# EAGLE design rev_3 (EAGLE 5.10)

## Sheet 1 of 2
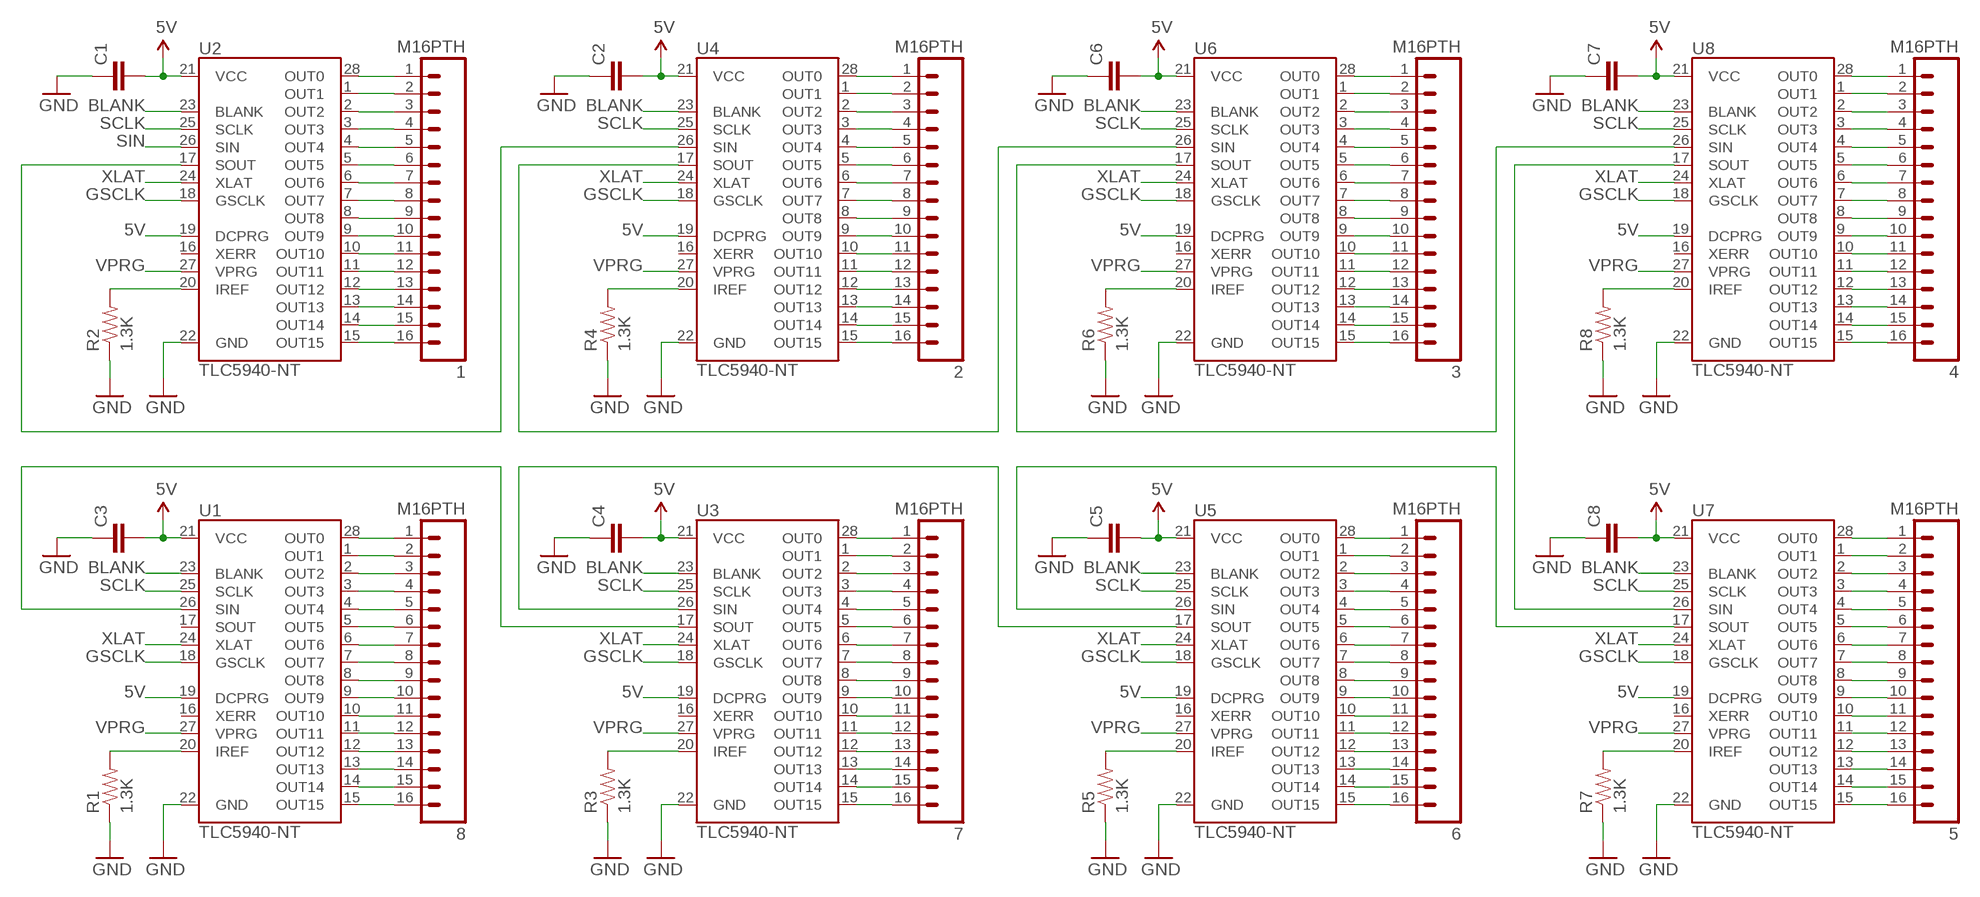
[diagram p0: schematic, sheet 1]

### Parts
1  M16PTH  [1X16]
2  M16PTH  [1X16]
3  M16PTH  [1X16]
4  M16PTH  [1X16]
5  M16PTH  [1X16]
6  M16PTH  [1X16]
7  M16PTH  [1X16]
8  M16PTH  [1X16]
C1  CAPKIT  [CAP-PTH-SMALL-KIT]
C2  CAPKIT  [CAP-PTH-SMALL-KIT]
C3  CAPKIT  [CAP-PTH-SMALL-KIT]
C4  CAPKIT  [CAP-PTH-SMALL-KIT]
C5  CAPKIT  [CAP-PTH-SMALL-KIT]
C6  CAPKIT  [CAP-PTH-SMALL-KIT]
C7  CAPKIT  [CAP-PTH-SMALL-KIT]
C8  CAPKIT  [CAP-PTH-SMALL-KIT]
R1  1.3K  RESISTORPTH-1/6W  [1/6W-RES]
R2  1.3K  RESISTORPTH-1/6W  [1/6W-RES]
R3  1.3K  RESISTORPTH-1/6W  [1/6W-RES]
R4  1.3K  RESISTORPTH-1/6W  [1/6W-RES]
R5  1.3K  RESISTORPTH-1/6W  [1/6W-RES]
R6  1.3K  RESISTORPTH-1/6W  [1/6W-RES]
R7  1.3K  RESISTORPTH-1/6W  [1/6W-RES]
R8  1.3K  RESISTORPTH-1/6W  [1/6W-RES]
U1  TLC5940-NT  [DIL28-3]
U2  TLC5940-NT  [DIL28-3]
U3  TLC5940-NT  [DIL28-3]
U4  TLC5940-NT  [DIL28-3]
U5  TLC5940-NT  [DIL28-3]
U6  TLC5940-NT  [DIL28-3]
U7  TLC5940-NT  [DIL28-3]
U8  TLC5940-NT  [DIL28-3]

### Nets
5V: C1.2 C2.2 C3.2 C4.2 C5.2 C6.2 C7.2 C8.2 U1.19(DCPRG) U1.21(VCC) U2.19(DCPRG) U2.21(VCC) U3.19(DCPRG) U3.21(VCC) U4.19(DCPRG) U4.21(VCC) U5.19(DCPRG) U5.21(VCC) U6.19(DCPRG) U6.21(VCC) U7.19(DCPRG) U7.21(VCC) U8.19(DCPRG) U8.21(VCC) ; also sheet 2
BLANK: U1.23(BLANK) U2.23(BLANK) U3.23(BLANK) U4.23(BLANK) U5.23(BLANK) U6.23(BLANK) U7.23(BLANK) U8.23(BLANK)
GND: C1.1 C2.1 C3.1 C4.1 C5.1 C6.1 C7.1 C8.1 R1.1 R2.1 R3.1 R4.1 R5.1 R6.1 R7.1 R8.1 U1.22(GND) U2.22(GND) U3.22(GND) U4.22(GND) U5.22(GND) U6.22(GND) U7.22(GND) U8.22(GND) ; also sheet 2
GSCLK: U1.18(GSCLK) U2.18(GSCLK) U3.18(GSCLK) U4.18(GSCLK) U5.18(GSCLK) U6.18(GSCLK) U7.18(GSCLK) U8.18(GSCLK)
N$1: 8.1 U1.28(OUT0)
N$2: 8.2 U1.1(OUT1)
N$3: 8.3 U1.2(OUT2)
N$4: 8.4 U1.3(OUT3)
N$5: 8.5 U1.4(OUT4)
N$6: 8.6 U1.5(OUT5)
N$7: 8.7 U1.6(OUT6)
N$8: 8.8 U1.7(OUT7)
N$9: 8.9 U1.8(OUT8)
N$10: 8.10 U1.9(OUT9)
N$11: 8.11 U1.10(OUT10)
N$12: 8.12 U1.11(OUT11)
N$13: 8.13 U1.12(OUT12)
N$14: 8.14 U1.13(OUT13)
N$15: 8.15 U1.14(OUT14)
N$16: 8.16 U1.15(OUT15)
N$17: R1.2 U1.20(IREF)
N$18: R2.2 U2.20(IREF)
N$19: 1.1 U2.28(OUT0)
N$20: 1.2 U2.1(OUT1)
N$23: 1.3 U2.2(OUT2)
N$24: 1.4 U2.3(OUT3)
N$25: 1.5 U2.4(OUT4)
N$26: 1.6 U2.5(OUT5)
N$27: 1.7 U2.6(OUT6)
N$28: 1.8 U2.7(OUT7)
N$29: 1.9 U2.8(OUT8)
N$30: 1.10 U2.9(OUT9)
N$31: 1.11 U2.10(OUT10)
N$32: 1.12 U2.11(OUT11)
N$33: 1.13 U2.12(OUT12)
N$34: 1.14 U2.13(OUT13)
N$35: 1.15 U2.14(OUT14)
N$36: 1.16 U2.15(OUT15)
N$37: U2.17(SOUT) U4.26(SIN)
N$39: R3.2 U3.20(IREF)
N$40: 7.1 U3.28(OUT0)
N$41: 7.2 U3.1(OUT1)
N$42: 7.3 U3.2(OUT2)
N$43: 7.4 U3.3(OUT3)
N$44: 7.5 U3.4(OUT4)
N$45: 7.6 U3.5(OUT5)
N$46: 7.7 U3.6(OUT6)
N$47: 7.8 U3.7(OUT7)
N$48: 7.9 U3.8(OUT8)
N$49: 7.10 U3.9(OUT9)
N$50: 7.11 U3.10(OUT10)
N$51: 7.12 U3.11(OUT11)
N$52: 7.13 U3.12(OUT12)
N$53: 7.14 U3.13(OUT13)
N$54: 7.15 U3.14(OUT14)
N$55: 7.16 U3.15(OUT15)
N$56: U1.26(SIN) U3.17(SOUT)
N$58: R4.2 U4.20(IREF)
N$59: 2.1 U4.28(OUT0)
N$60: 2.2 U4.1(OUT1)
N$61: 2.3 U4.2(OUT2)
N$62: 2.4 U4.3(OUT3)
N$63: 2.5 U4.4(OUT4)
N$64: 2.6 U4.5(OUT5)
N$65: 2.7 U4.6(OUT6)
N$66: 2.8 U4.7(OUT7)
N$67: 2.9 U4.8(OUT8)
N$68: 2.10 U4.9(OUT9)
N$69: 2.11 U4.10(OUT10)
N$70: 2.12 U4.11(OUT11)
N$71: 2.13 U4.12(OUT12)
N$72: 2.14 U4.13(OUT13)
N$73: 2.15 U4.14(OUT14)
N$74: 2.16 U4.15(OUT15)
N$75: U4.17(SOUT) U6.26(SIN)
N$77: R5.2 U5.20(IREF)
N$78: 6.1 U5.28(OUT0)
N$79: 6.2 U5.1(OUT1)
N$80: 6.3 U5.2(OUT2)
N$81: 6.4 U5.3(OUT3)
N$82: 6.5 U5.4(OUT4)
N$83: 6.6 U5.5(OUT5)
N$84: 6.7 U5.6(OUT6)
N$85: 6.8 U5.7(OUT7)
N$86: 6.9 U5.8(OUT8)
N$87: 6.10 U5.9(OUT9)
N$88: 6.11 U5.10(OUT10)
N$89: 6.12 U5.11(OUT11)
N$90: 6.13 U5.12(OUT12)
N$91: 6.14 U5.13(OUT13)
N$92: 6.15 U5.14(OUT14)
N$93: 6.16 U5.15(OUT15)
N$94: U3.26(SIN) U5.17(SOUT)
N$96: R6.2 U6.20(IREF)
N$97: 3.1 U6.28(OUT0)
N$98: 3.2 U6.1(OUT1)
N$99: 3.3 U6.2(OUT2)
N$100: 3.4 U6.3(OUT3)
N$101: 3.5 U6.4(OUT4)
N$102: 3.6 U6.5(OUT5)
N$103: 3.7 U6.6(OUT6)
N$104: 3.8 U6.7(OUT7)
N$105: 3.9 U6.8(OUT8)
N$106: 3.10 U6.9(OUT9)
N$107: 3.11 U6.10(OUT10)
N$108: 3.12 U6.11(OUT11)
N$109: 3.13 U6.12(OUT12)
N$110: 3.14 U6.13(OUT13)
N$111: 3.15 U6.14(OUT14)
N$112: 3.16 U6.15(OUT15)
N$113: U6.17(SOUT) U8.26(SIN)
N$115: R7.2 U7.20(IREF)
N$116: 5.1 U7.28(OUT0)
N$117: 5.2 U7.1(OUT1)
N$118: 5.3 U7.2(OUT2)
N$119: 5.4 U7.3(OUT3)
N$120: 5.5 U7.4(OUT4)
N$121: 5.6 U7.5(OUT5)
N$122: 5.7 U7.6(OUT6)
N$123: 5.8 U7.7(OUT7)
N$124: 5.9 U7.8(OUT8)
N$125: 5.10 U7.9(OUT9)
N$126: 5.11 U7.10(OUT10)
N$127: 5.12 U7.11(OUT11)
N$128: 5.13 U7.12(OUT12)
N$129: 5.14 U7.13(OUT13)
N$130: 5.15 U7.14(OUT14)
N$131: 5.16 U7.15(OUT15)
N$132: U5.26(SIN) U7.17(SOUT)
N$134: R8.2 U8.20(IREF)
N$135: 4.1 U8.28(OUT0)
N$136: 4.2 U8.1(OUT1)
N$137: 4.3 U8.2(OUT2)
N$138: 4.4 U8.3(OUT3)
N$139: 4.5 U8.4(OUT4)
N$140: 4.6 U8.5(OUT5)
N$141: 4.7 U8.6(OUT6)
N$142: 4.8 U8.7(OUT7)
N$143: 4.9 U8.8(OUT8)
N$144: 4.10 U8.9(OUT9)
N$145: 4.11 U8.10(OUT10)
N$146: 4.12 U8.11(OUT11)
N$147: 4.13 U8.12(OUT12)
N$148: 4.14 U8.13(OUT13)
N$149: 4.15 U8.14(OUT14)
N$150: 4.16 U8.15(OUT15)
N$151: U7.26(SIN) U8.17(SOUT)
SCLK: U1.25(SCLK) U2.25(SCLK) U3.25(SCLK) U4.25(SCLK) U5.25(SCLK) U6.25(SCLK) U7.25(SCLK) U8.25(SCLK)
SIN: U2.26(SIN)
VPRG: U1.27(VPRG) U2.27(VPRG) U3.27(VPRG) U4.27(VPRG) U5.27(VPRG) U6.27(VPRG) U7.27(VPRG) U8.27(VPRG)
XLAT: U1.24(XLAT) U2.24(XLAT) U3.24(XLAT) U4.24(XLAT) U5.24(XLAT) U6.24(XLAT) U7.24(XLAT) U8.24(XLAT)
Unconnected: U1.16(XERR) U1.17(SOUT) U2.16(XERR) U3.16(XERR) U4.16(XERR) U5.16(XERR) U6.16(XERR) U7.16(XERR) U8.16(XERR)

## Sheet 2 of 2
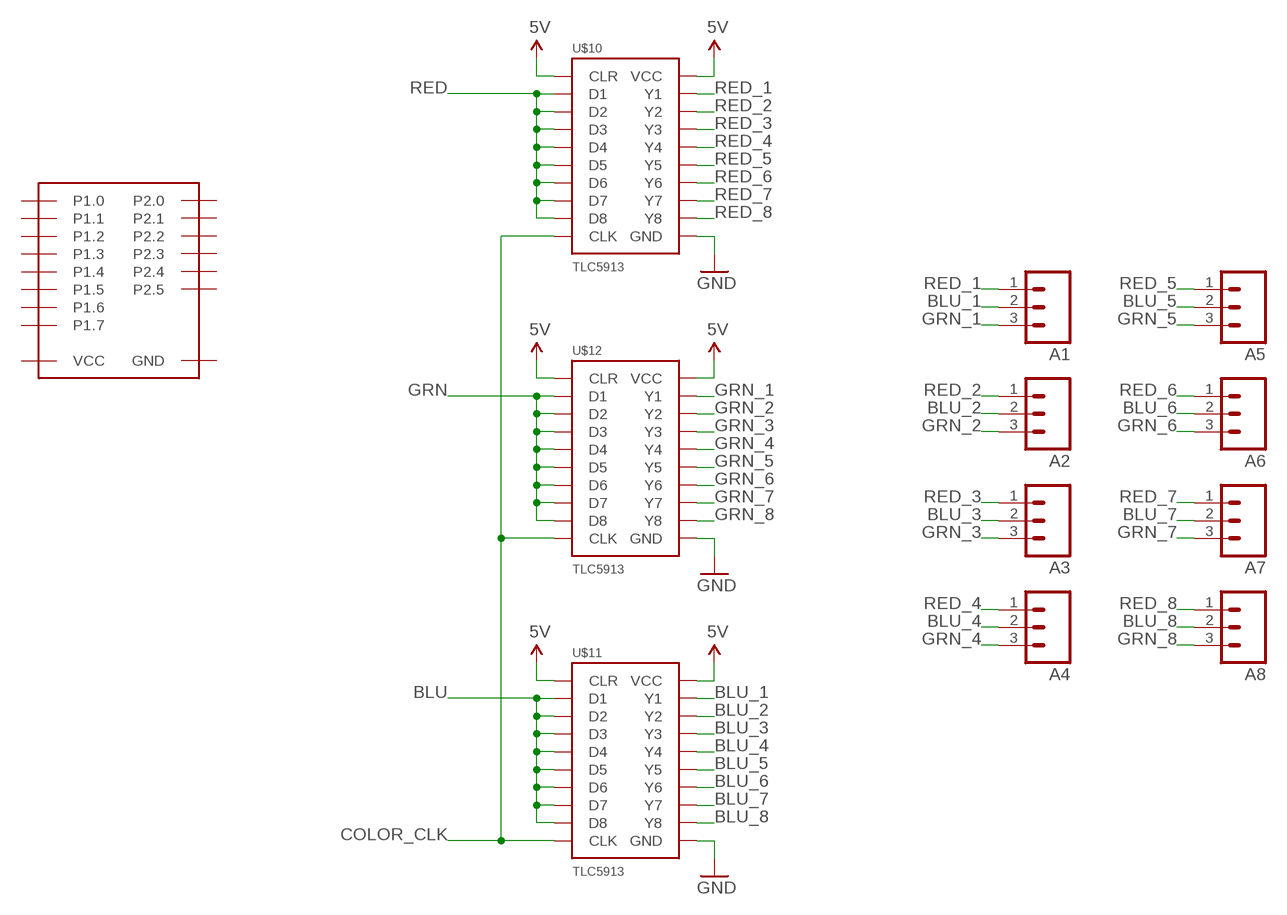
[diagram p1: schematic, sheet 2]

### Parts
A1  M03PTH  [1X03]
A2  M03PTH  [1X03]
A3  M03PTH  [1X03]
A4  M03PTH  [1X03]
A5  M03PTH  [1X03]
A6  M03PTH  [1X03]
A7  M03PTH  [1X03]
A8  M03PTH  [1X03]
U$9  TI_LAUNCHPAD  [TI_LAUNCHPAD]
U$10  TLC5913  [TLC59213]
U$11  TLC5913  [TLC59213]
U$12  TLC5913  [TLC59213]

### Nets
5V: U$10.CLR U$10.VCC U$11.CLR U$11.VCC U$12.CLR U$12.VCC ; also sheet 1
BLU: U$11.D1 U$11.D2 U$11.D3 U$11.D4 U$11.D5 U$11.D6 U$11.D7 U$11.D8
BLU_1: A1.2 U$11.Y1
BLU_2: A2.2 U$11.Y2
BLU_3: A3.2 U$11.Y3
BLU_4: A4.2 U$11.Y4
BLU_5: A5.2 U$11.Y5
BLU_6: A6.2 U$11.Y6
BLU_7: A7.2 U$11.Y7
BLU_8: A8.2 U$11.Y8
COLOR_CLK: U$10.CLK U$11.CLK U$12.CLK
GND: U$10.GND U$11.GND U$12.GND ; also sheet 1
GRN: U$12.D1 U$12.D2 U$12.D3 U$12.D4 U$12.D5 U$12.D6 U$12.D7 U$12.D8
GRN_1: A1.3 U$12.Y1
GRN_2: A2.3 U$12.Y2
GRN_3: A3.3 U$12.Y3
GRN_4: A4.3 U$12.Y4
GRN_5: A5.3 U$12.Y5
GRN_6: A6.3 U$12.Y6
GRN_7: A7.3 U$12.Y7
GRN_8: A8.3 U$12.Y8
RED: U$10.D1 U$10.D2 U$10.D3 U$10.D4 U$10.D5 U$10.D6 U$10.D7 U$10.D8
RED_1: A1.1 U$10.Y1
RED_2: A2.1 U$10.Y2
RED_3: A3.1 U$10.Y3
RED_4: A4.1 U$10.Y4
RED_5: A5.1 U$10.Y5
RED_6: A6.1 U$10.Y6
RED_7: A7.1 U$10.Y7
RED_8: A8.1 U$10.Y8
Unconnected: U$9.GND U$9.P1.0 U$9.P1.1 U$9.P1.2 U$9.P1.3 U$9.P1.4 U$9.P1.5 U$9.P1.6 U$9.P1.7 U$9.P2.0 U$9.P2.1 U$9.P2.2 U$9.P2.3 U$9.P2.4 U$9.P2.5 U$9.VCC

## Library data of the parts
1-8 = SparkFun:M16
A1-A8 = SparkFun:M03: Header 3 Standard 3-pin 0.1" header. Use with straight break away headers (SKU : PRT-00116), right angle break away headers (PRT-00553), swiss pins (PRT-00743), machine pins (PRT-00117), and female headers (PRT-00115). Molex polarized connector foot print use with SKU : PRT-08232 with associated crimp pins and housings.
C1-C8 = SparkFun:CAP: Capacitor Standard 0603 ceramic capacitor, and 0.1" leaded capacitor.
R1-R8 = SparkFun:RESISTOR: Resistor Basic schematic elements and footprints for 0603, 1206, and PTH resistors.
U1-U8 = SparkFun:TLC5940: TI TLC5940 16-channel LED Driver with Dot Correction and Grayscale PWM Control The TLC5940 is a 16-channel, constant-current sink LED driver. Each channel has an individually adjustable 4096-step grayscale PWM brightness control and a 64-step, constant-current sink (dot correction). The dot correction adjusts the brightness variations between LED channels and other LED drivers. The dot correction data is stored in an integrated EEPROM. Both grayscale control and dot correction are accessible via a serial interface. A single external resistor sets the maximum current value of all 16 channels. Packages: 28-pin HTSSOP 32-pin 5x5mm QFN 28-pin DIP
U$9 = launchpad_comp:TI_LAUNCHPAD
U$10-U$12 = launchpad_comp:TLC5913: TLC59213A http://focus.ti.com/docs/prod/folders/print/tlc59213a.html; VALUE: TLC59213A

## Board
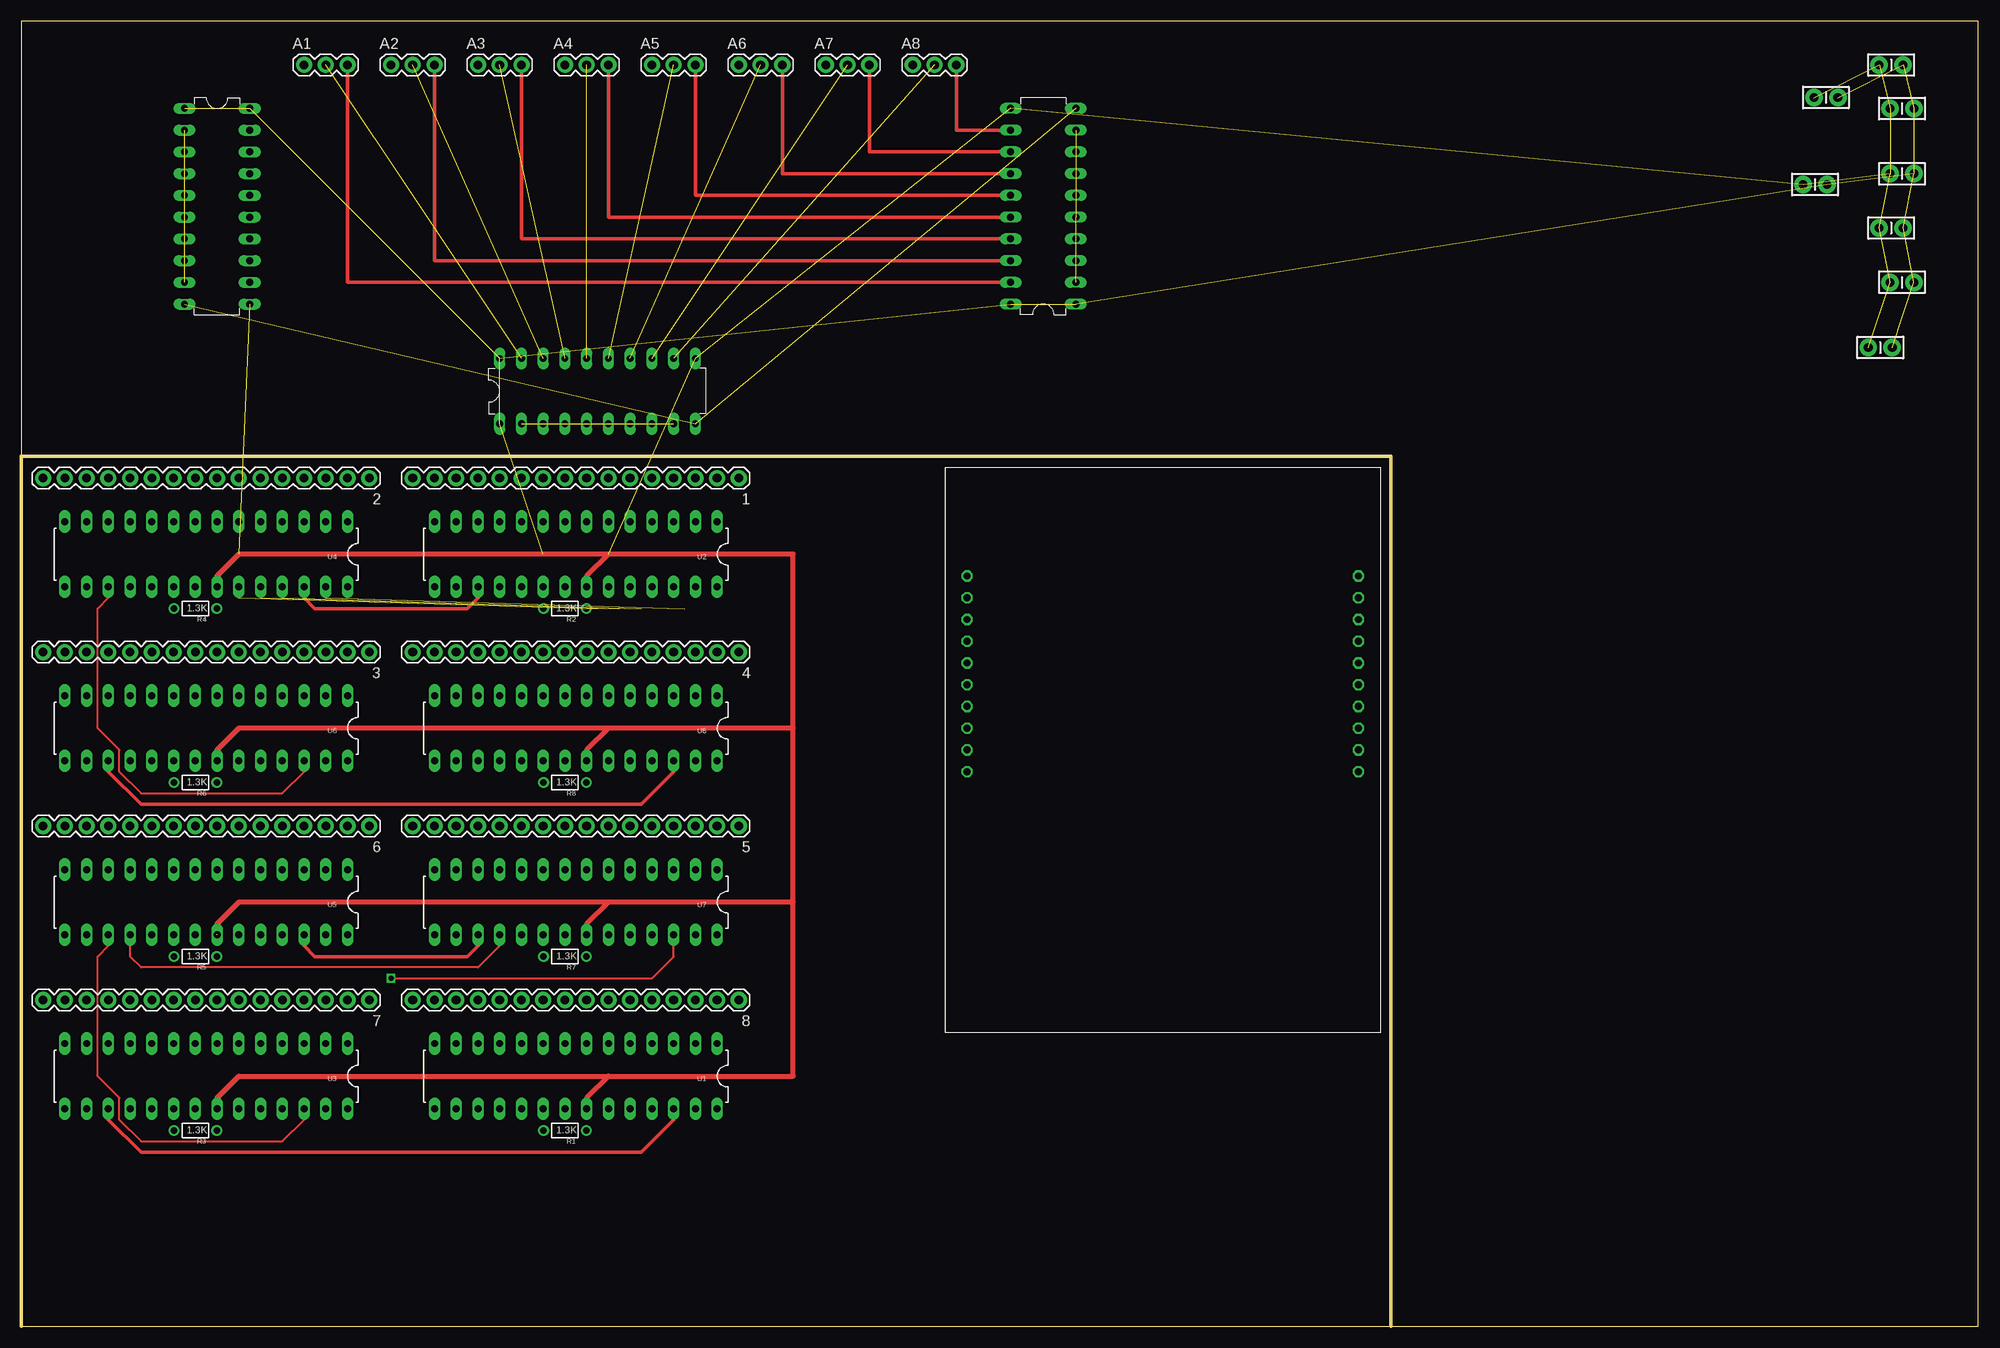
[diagram p2: board, top side]
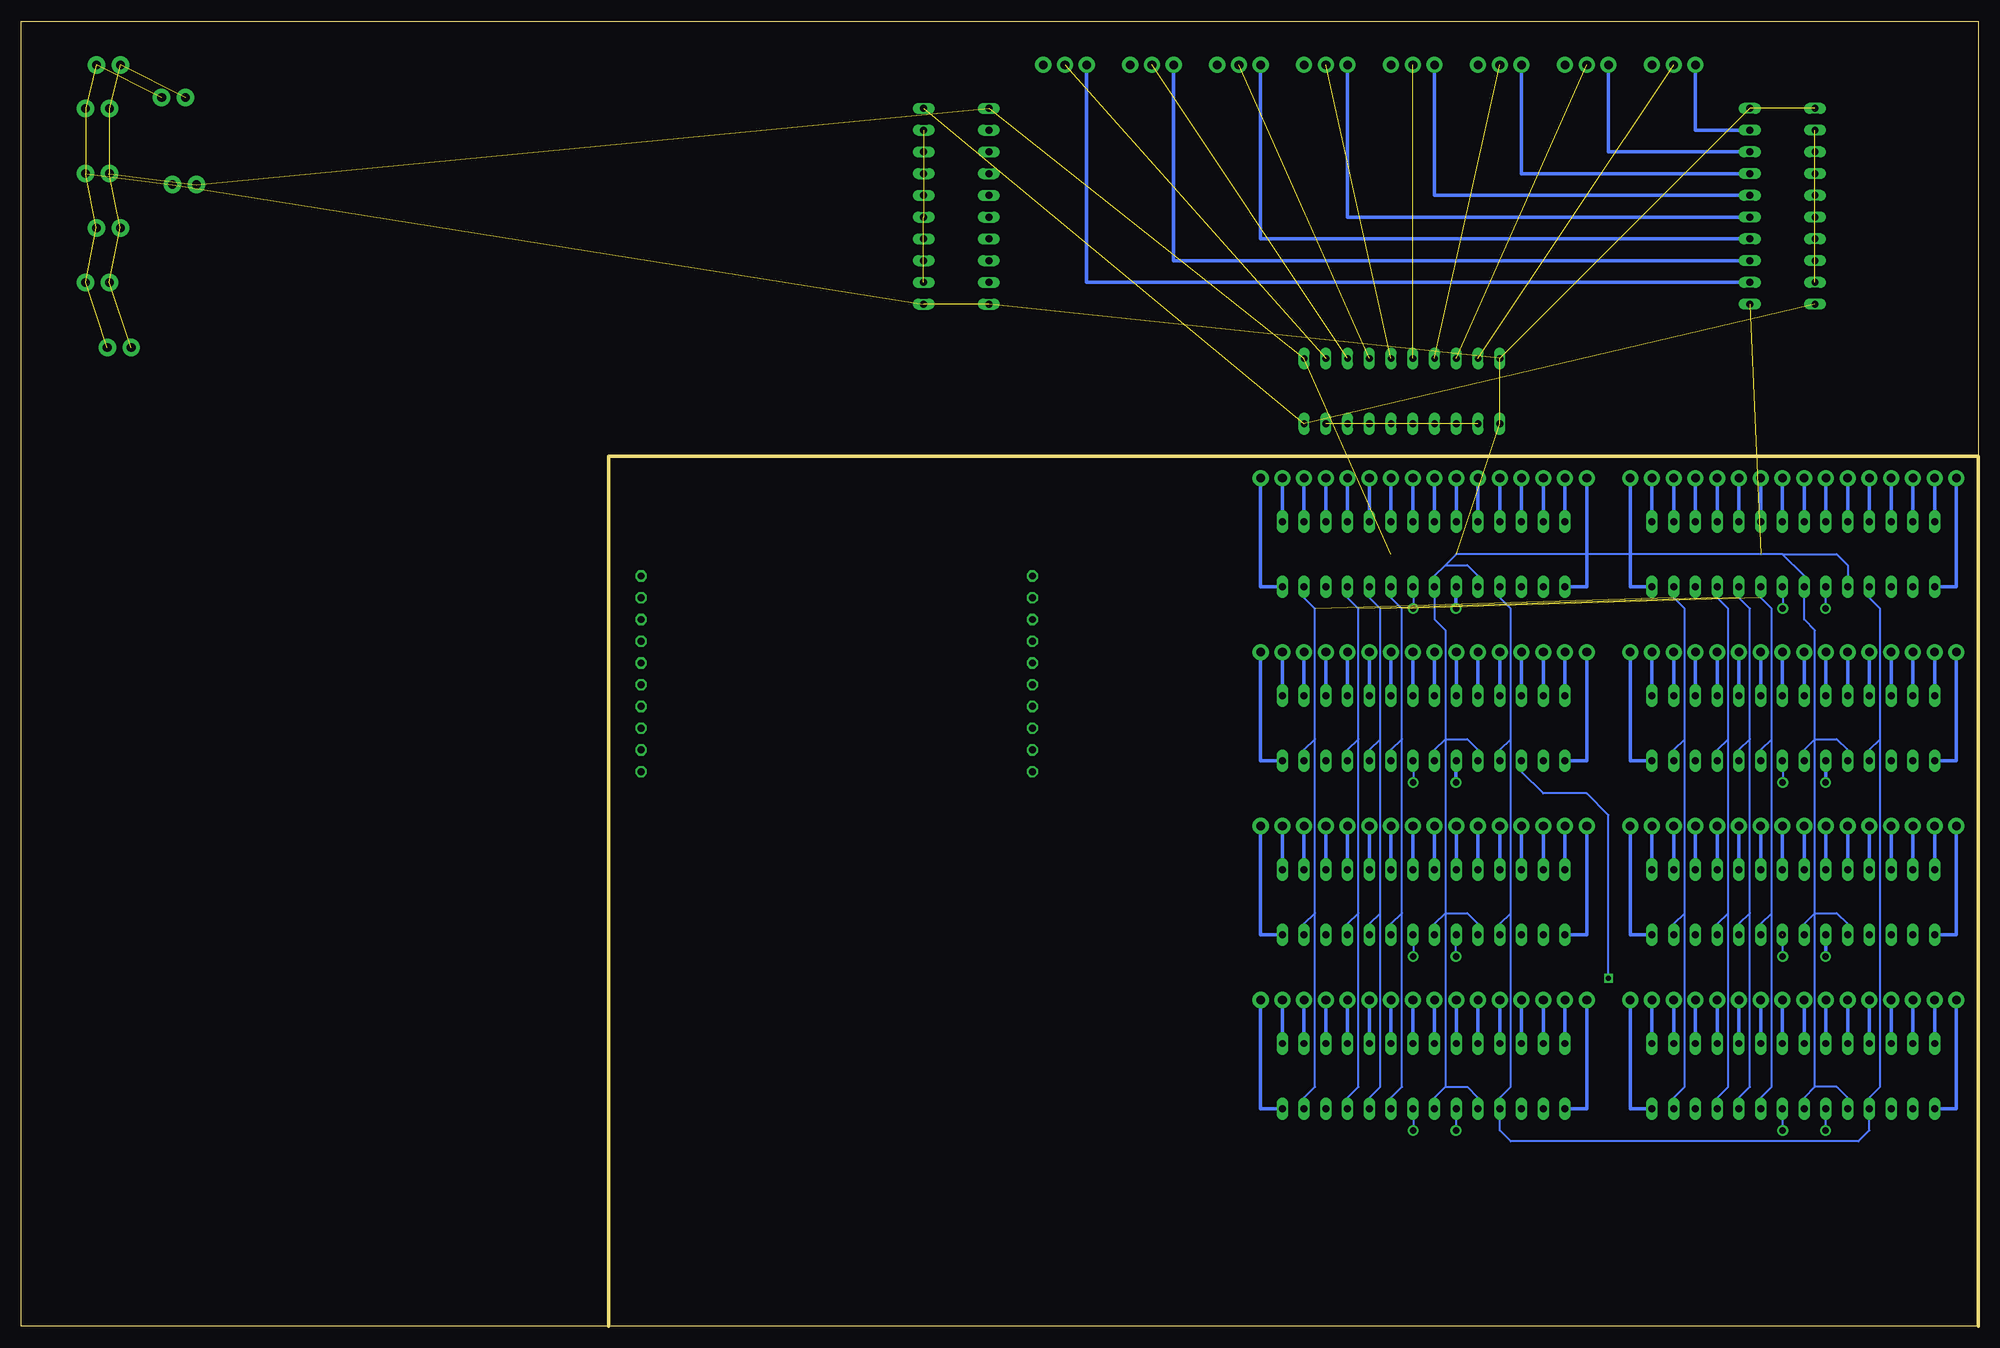
[diagram p3: board, bottom side, seen from below]

Size 228.6 x 152.4 mm. Coordinates in mm from the lower left corner, seen from the top.
Outline: 160.02,0 0,0 0,101.6
Outline: 160.02,0 228.6,0 228.6,152.4 0,152.4 0,101.6
Outline: 0,101.6 160.02,101.6 160.02,0
Copper layers (1*16): Top 0.0356mm / dielectric 1.5011mm / Bottom 0.0356mm
Design rules "SilverCircuits": minimum track width 7mil, minimum drill 14mil, track to track 7mil, track to pad 7mil, pad to pad 7mil, via to via 7mil, smd to smd 0mil, copper to edge 20mil, drill to drill 8mil, minimum pad ring 10mil, minimum via ring 8mil, stop-mask expansion 4mil, vias tented up to drill 0mil, thermal gap 10mil

### Footprints (pad centres in the part's own frame; a part is rotated, then mirrored left to right if it is on the bottom)
1X16 = drill 1.016 pad 1.88 round: 1 0,0; 2 2.54,0; 3 5.08,0; 4 7.62,0; 5 10.16,0; 6 12.7,0; 7 15.24,0; 8 17.78,0; 9 20.32,0; 10 22.86,0; 11 25.4,0; 12 27.94,0; 13 30.48,0; 14 33.02,0; 15 35.56,0; 16 38.1,0
1X03 = drill 1.016 pad 1.88 round: 1 0,0; 2 2.54,0; 3 5.08,0
CAP-PTH-SMALL-KIT = drill 1.016 pad 2.032 round: 1 -1.397,0; 2 1.397,0
1/6W-RES = drill 0.762 round: 1 -2.5,0; 2 2.5,0
DIL28-3 = drill 0.813 long: 1 -16.51,-3.81; 2 -13.97,-3.81; 3 -11.43,-3.81; 4 -8.89,-3.81; 5 -6.35,-3.81; 6 -3.81,-3.81; 7 -1.27,-3.81; 8 1.27,-3.81; 9 3.81,-3.81; 10 6.35,-3.81; 11 8.89,-3.81; 12 11.43,-3.81; 13 13.97,-3.81; 14 16.51,-3.81; 15 16.51,3.81; 16 13.97,3.81; 17 11.43,3.81; 18 8.89,3.81; 19 6.35,3.81; 20 3.81,3.81; 21 1.27,3.81; 22 -1.27,3.81; 23 -3.81,3.81; 24 -6.35,3.81; 25 -8.89,3.81; 26 -11.43,3.81; 27 -13.97,3.81; 28 -16.51,3.81
TI_LAUNCHPAD = drill 0.8 octagon: GND 48.26,35.56; P1.0 2.54,33.02; P1.1 2.54,30.48; P1.2 2.54,27.94; P1.3 2.54,25.4; P1.4 2.54,22.86; P1.5 2.54,20.32; P1.6 48.26,20.32; P1.7 48.26,22.86; P2.0 2.54,17.78; P2.1 2.54,15.24; P2.2 2.54,12.7; P2.3 48.26,12.7; P2.4 48.26,15.24; P2.5 48.26,17.78; RST 48.26,25.4; TEST 48.26,27.94; VCC 2.54,35.56; XIN 48.26,33.02; XOUT 48.26,30.48
TLC59213 = drill 0.8 long: CLK -10.16,3.81; CLR 12.7,3.81; D1 10.16,3.81; D2 7.62,3.81; D3 5.08,3.81; D4 2.54,3.81; D5 0,3.81; D6 -2.54,3.81; D7 -5.08,3.81; D8 -7.62,3.81; GND -10.16,-3.81; VCC 12.7,-3.81; Y1 10.16,-3.81; Y2 7.62,-3.81; Y3 5.08,-3.81; Y4 2.54,-3.81; Y5 0,-3.81; Y6 -2.54,-3.81; Y7 -5.08,-3.81; Y8 -7.62,-3.81

### Placement (x,y rotation side)
1  83.82,99.06 180 top
2  40.64,99.06 180 top
3  40.64,78.74 180 top
4  83.82,78.74 180 top
5  83.82,58.42 180 top
6  40.64,58.42 180 top
7  40.64,38.1 180 top
8  83.82,38.1 180 top
A1  33.02,147.32 0 top
A2  43.18,147.32 0 top
A3  53.34,147.32 0 top
A4  63.5,147.32 0 top
A5  73.66,147.32 0 top
A6  83.82,147.32 0 top
A7  93.98,147.32 0 top
A8  104.14,147.32 0 top
C1  219.71,121.92 0 top
C2  217.17,114.3 0 top
C3  210.82,143.51 0 top
C4  209.55,133.35 0 top
C5  219.71,134.62 0 top
C6  218.44,128.27 0 top
C7  218.44,147.32 0 top
C8  219.71,142.24 0 top
R1  63.5,22.86 180 top
R2  63.5,83.82 180 top
R3  20.32,22.86 180 top
R4  20.32,83.82 180 top
R5  20.32,43.18 180 top
R6  20.32,63.5 180 top
R7  63.5,43.18 180 top
R8  63.5,63.5 180 top
U1  64.77,29.21 180 top
U2  64.77,90.17 180 top
U3  21.59,29.21 180 top
U4  21.59,90.17 180 top
U5  21.59,49.53 180 top
U6  21.59,69.85 180 top
U7  64.77,49.53 180 top
U8  64.77,69.85 180 top
U$9  158.75,100.33 180 top
U$10  22.86,129.54 90 top
U$11  68.58,109.22 180 top
U$12  119.38,132.08 270 top

### Tracks (layer width: path | path; a pad name or v marks a point on that pad's centre or on a via)
5V  (14 unrouted)
  Bottom 0.254: 62.23,68.58 62.23,81.28 63.5,82.55 U2.21 63.5,87.63 62.23,88.9 | 62.23,68.58 62.23,48.26 | 62.23,48.26 62.23,27.94 | 62.23,27.94 63.5,26.67 U1.21 | U7.21 63.5,46.99 62.23,48.26 | U8.21 63.5,67.31 62.23,68.58 | 19.05,68.58 19.05,81.28 20.32,82.55 U4.21 20.32,87.63 22.86,90.17 | 19.05,48.26 19.05,68.58 | 19.05,27.94 19.05,48.26 | 19.05,27.94 20.32,26.67 U3.21 | U5.21 20.32,46.99 19.05,48.26 | U6.21 20.32,67.31 19.05,68.58 | 22.86,90.17 60.96,90.17 62.23,88.9 | U4.19 15.24,88.9 16.51,90.17 22.86,90.17 | U6.19 15.24,67.31 16.51,68.58 19.05,68.58 | U5.19 15.24,46.99 16.51,48.26 19.05,48.26 | U3.19 15.24,26.67 16.51,27.94 19.05,27.94 | U1.19 58.42,26.67 59.69,27.94 62.23,27.94 | U7.19 58.42,46.99 59.69,48.26 62.23,48.26 | U8.19 58.42,67.31 59.69,68.58 62.23,68.58 | U2.19 58.42,87.63 59.69,88.9 62.23,88.9
BLANK  (1 unrouted)
  Bottom 0.254: U2.23 68.58,85.09 67.31,83.82 67.31,68.58 | 67.31,48.26 67.31,68.58 | 67.31,48.26 67.31,27.94 68.58,26.67 U1.23 | U7.23 68.58,46.99 67.31,48.26 | U8.23 68.58,67.31 67.31,68.58 | U4.23 25.4,85.09 24.13,83.82 24.13,68.58 | 24.13,48.26 24.13,68.58 | 24.13,48.26 24.13,27.94 25.4,26.67 U3.23 | U5.23 25.4,46.99 24.13,48.26 | U6.23 25.4,67.31 24.13,68.58
BLU  (7 unrouted)
BLU_1  (1 unrouted)
BLU_2  (1 unrouted)
BLU_3  (1 unrouted)
BLU_4  (1 unrouted)
BLU_5  (1 unrouted)
BLU_6  (1 unrouted)
BLU_7  (1 unrouted)
BLU_8  (1 unrouted)
COLOR_CLK  (2 unrouted)
GND  (12 unrouted)
  Top 0.61: U4.22 22.86,87.63 25.4,90.17 68.58,90.17 | U2.22 66.04,87.63 68.58,90.17 | U6.22 22.86,67.31 25.4,69.85 68.58,69.85 | U8.22 66.04,67.31 68.58,69.85 | U3.22 22.86,26.67 25.4,29.21 68.58,29.21 | 22.82,45.72 22.82,46.95 25.4,49.53 68.58,49.53 | 90.17,49.53 68.58,49.53 | U1.22 66.04,26.67 68.58,29.21 | U7.22 66.04,46.99 68.58,49.53 | 68.58,29.21 90.17,29.21 90.17,49.53 | 90.17,69.85 68.58,69.85 | 90.17,49.53 90.17,69.85 | 68.58,90.17 90.17,90.17 90.17,69.85
  Bottom 0.254: R4.1 22.82,86.32 U4.22 | R2.1 66,86.32 U2.22 | R8.1 66,66 U8.22 | R6.1 22.82,66 U6.22 | R5.1 22.82,45.68 U5.22 | R7.1 66,45.68 U7.22 | R1.1 66,25.36 U1.22 | R3.1 22.82,25.36 U3.22
  Bottom 0.406: U2.22 66,86.36
GRN  (7 unrouted)
GRN_1
  Top 0.406: U$12.Y1 38.1,121.92 A1.3
GRN_2
  Top 0.406: U$12.Y2 48.26,124.46 A2.3
GRN_3
  Top 0.406: U$12.Y3 58.42,127 A3.3
GRN_4
  Top 0.406: U$12.Y4 68.58,129.54 A4.3
GRN_5
  Top 0.406: U$12.Y5 78.74,132.08 A5.3
GRN_6
  Top 0.406: U$12.Y6 88.9,134.62 A6.3
GRN_7
  Top 0.406: U$12.Y7 99.06,137.16 A7.3
GRN_8
  Top 0.406: U$12.Y8 109.22,139.7 A8.3
GSCLK
  Top 0.254: U5.18 12.7,43.18 13.97,41.91 53.34,41.91 55.88,44.45 U7.18
  Bottom 0.254: U2.18 55.88,85.09 54.61,83.82 54.61,68.58 | 54.61,48.26 54.61,68.58 | U8.18 55.88,67.31 54.61,68.58 | U4.18 12.7,85.09 11.43,83.82 11.43,68.58 | 11.43,68.58 11.43,27.94 12.7,26.67 U3.18 12.7,22.86 13.97,21.59 54.61,21.59 55.88,22.86 U1.18 55.88,26.67 54.61,27.94 54.61,48.26 | U6.18 12.7,67.31 11.43,68.58 | 54.61,48.26 55.88,46.99 U7.18
N$1
  Bottom 0.406: U1.28 83.82,25.4 8.1
N$2
  Bottom 0.406: U1.1 8.2
N$3
  Bottom 0.406: U1.2 8.3
N$4
  Bottom 0.406: U1.3 8.4
N$5
  Bottom 0.406: U1.4 8.5
N$6
  Bottom 0.406: U1.5 8.6
N$7
  Bottom 0.406: U1.6 8.7
N$8
  Bottom 0.406: U1.7 8.8
N$9
  Bottom 0.406: U1.8 8.9
N$10
  Bottom 0.406: U1.9 8.10
N$11
  Bottom 0.406: U1.10 8.11
N$12
  Bottom 0.406: U1.11 8.12
N$13
  Bottom 0.406: U1.12 8.13
N$14
  Bottom 0.406: U1.13 8.14
N$15
  Bottom 0.406: U1.14 8.15
N$16
  Bottom 0.406: U1.15 45.72,25.4 8.16
N$17
  Bottom 0.254: U1.20 60.96,22.9 R1.2
N$18
  Bottom 0.406: U2.20 61,86.36 R2.2
N$19
  Bottom 0.406: U2.28 83.82,86.36 1.1
N$20
  Bottom 0.406: U2.1 1.2
N$23
  Bottom 0.406: U2.2 1.3
N$24
  Bottom 0.406: U2.3 1.4
N$25
  Bottom 0.406: U2.4 1.5
N$26
  Bottom 0.406: U2.5 1.6
N$27
  Bottom 0.406: U2.6 1.7
N$28
  Bottom 0.406: U2.7 1.8
N$29
  Bottom 0.406: U2.8 1.9
N$30
  Bottom 0.406: U2.9 1.10
N$31
  Bottom 0.406: U2.10 1.11
N$32
  Bottom 0.406: U2.11 1.12
N$33
  Bottom 0.406: U2.12 1.13
N$34
  Bottom 0.406: U2.13 1.14
N$35
  Bottom 0.406: U2.14 1.15
N$36
  Bottom 0.406: U2.15 45.72,86.36 1.16
N$37
  Top 0.406: U4.26 33.02,85.09 34.29,83.82 52.07,83.82 53.34,85.09 U2.17
N$39
  Bottom 0.254: U3.20 17.78,22.9 R3.2
N$40
  Bottom 0.406: U3.28 40.64,25.4 7.1
N$41
  Bottom 0.406: U3.1 7.2
N$42
  Bottom 0.406: U3.2 7.3
N$43
  Bottom 0.406: U3.3 7.4
N$44
  Bottom 0.406: U3.4 7.5
N$45
  Bottom 0.406: U3.5 7.6
N$46
  Bottom 0.406: U3.6 7.7
N$47
  Bottom 0.406: U3.7 7.8
N$48
  Bottom 0.406: U3.8 7.9
N$49
  Bottom 0.406: U3.9 7.10
N$50
  Bottom 0.406: U3.10 7.11
N$51
  Bottom 0.406: U3.11 7.12
N$52
  Bottom 0.406: U3.12 7.13
N$53
  Bottom 0.406: U3.13 7.14
N$54
  Bottom 0.406: U3.14 7.15
N$55
  Bottom 0.406: U3.15 2.54,25.4 7.16
N$56
  Top 0.406: U3.17 10.16,24.13 13.97,20.32 72.39,20.32 76.2,24.13 U1.26
N$58
  Bottom 0.254: U4.20 17.78,83.86 R4.2
N$59
  Bottom 0.406: U4.28 40.64,86.36 2.1
N$60
  Bottom 0.406: U4.1 2.2
N$61
  Bottom 0.406: U4.2 2.3
N$62
  Bottom 0.406: U4.3 2.4
N$63
  Bottom 0.406: U4.4 2.5
N$64
  Bottom 0.406: U4.5 2.6
N$65
  Bottom 0.406: U4.6 2.7
N$66
  Bottom 0.406: U4.7 2.8
N$67
  Bottom 0.406: U4.8 2.9
N$68
  Bottom 0.406: U4.9 2.10
N$69
  Bottom 0.406: U4.10 2.11
N$70
  Bottom 0.406: U4.11 2.12
N$71
  Bottom 0.406: U4.12 2.13
N$72
  Bottom 0.406: U4.13 2.14
N$73
  Bottom 0.406: U4.14 2.15
N$74
  Bottom 0.406: U4.15 2.54,86.36 2.16
N$75
  Top 0.254: U6.26 33.02,64.77 30.48,62.23 13.97,62.23 11.43,64.77 11.43,67.31 8.89,69.85 8.89,83.82 10.16,85.09 U4.17
N$77  (1 unrouted)
  Bottom 0.406: 17.78,43.18 U5.20
N$78
  Bottom 0.406: U5.28 40.64,45.72 6.1
N$79
  Bottom 0.406: U5.1 6.2
N$80
  Bottom 0.406: U5.2 6.3
N$81
  Bottom 0.406: U5.3 6.4
N$82
  Bottom 0.406: U5.4 6.5
N$83
  Bottom 0.406: U5.5 6.6
N$84
  Bottom 0.406: U5.6 6.7
N$85
  Bottom 0.406: U5.7 6.8
N$86
  Bottom 0.406: U5.8 6.9
N$87
  Bottom 0.406: U5.9 6.10
N$88
  Bottom 0.406: U5.10 6.11
N$89
  Bottom 0.406: U5.11 6.12
N$90
  Bottom 0.406: U5.12 6.13
N$91
  Bottom 0.406: U5.13 6.14
N$92
  Bottom 0.406: U5.14 6.15
N$93
  Bottom 0.406: U5.15 2.54,45.72 6.16
N$94
  Top 0.254: U3.26 33.02,24.13 30.48,21.59 13.97,21.59 11.43,24.13 11.43,26.67 8.89,29.21 8.89,43.18 10.16,44.45 U5.17
N$96
  Bottom 0.406: R6.2 17.78,63.5 U6.20
N$97
  Bottom 0.406: U6.28 40.64,66.04 3.1
N$98
  Bottom 0.406: U6.1 3.2
N$99
  Bottom 0.406: U6.2 3.3
N$100
  Bottom 0.406: U6.3 3.4
N$101
  Bottom 0.406: U6.4 3.5
N$102
  Bottom 0.406: U6.5 3.6
N$103
  Bottom 0.406: U6.6 3.7
N$104
  Bottom 0.406: U6.7 3.8
N$105
  Bottom 0.406: U6.8 3.9
N$106
  Bottom 0.406: U6.9 3.10
N$107
  Bottom 0.406: U6.10 3.11
N$108
  Bottom 0.406: U6.11 3.12
N$109
  Bottom 0.406: U6.12 3.13
N$110
  Bottom 0.406: U6.13 3.14
N$111
  Bottom 0.406: U6.14 3.15
N$112
  Bottom 0.406: U6.15 2.54,66.04 3.16
N$113
  Top 0.406: U6.17 10.16,64.77 13.97,60.96 72.39,60.96 76.2,64.77 U8.26
N$115
  Bottom 0.254: R7.2 61,45.68 U7.20
N$116
  Bottom 0.406: U7.28 83.82,45.72 5.1
N$117
  Bottom 0.406: U7.1 5.2
N$118
  Bottom 0.406: U7.2 5.3
N$119
  Bottom 0.406: U7.3 5.4
N$120
  Bottom 0.406: U7.4 5.5
N$121
  Bottom 0.406: U7.5 5.6
N$122
  Bottom 0.406: U7.6 5.7
N$123
  Bottom 0.406: U7.7 5.8
N$124
  Bottom 0.406: U7.8 5.9
N$125
  Bottom 0.406: U7.9 5.10
N$126
  Bottom 0.406: U7.10 5.11
N$127
  Bottom 0.406: U7.11 5.12
N$128
  Bottom 0.406: U7.12 5.13
N$129
  Bottom 0.406: U7.13 5.14
N$130
  Bottom 0.406: U7.14 5.15
N$131
  Bottom 0.406: U7.15 45.72,45.72 5.16
N$132
  Top 0.406: U5.26 33.02,44.45 34.29,43.18 52.07,43.18 53.34,44.45 U7.17
N$134
  Bottom 0.406: U8.20 61,66.04 R8.2
N$135
  Bottom 0.406: U8.28 83.82,66.04 4.1
N$136
  Bottom 0.406: U8.1 4.2
N$137
  Bottom 0.406: U8.2 4.3
N$138
  Bottom 0.406: U8.3 4.4
N$139
  Bottom 0.406: U8.4 4.5
N$140
  Bottom 0.406: U8.5 4.6
N$141
  Bottom 0.406: U8.6 4.7
N$142
  Bottom 0.406: U8.7 4.8
N$143
  Bottom 0.406: U8.8 4.9
N$144
  Bottom 0.406: U8.9 4.10
N$145
  Bottom 0.406: U8.10 4.11
N$146
  Bottom 0.406: U8.11 4.12
N$147
  Bottom 0.406: U8.12 4.13
N$148
  Bottom 0.406: U8.13 4.14
N$149
  Bottom 0.406: U8.14 4.15
N$150
  Bottom 0.406: U8.15 45.72,66.04 4.16
N$151  (via drill 0.6)
  Top 0.254: U7.26 76.2,43.18 73.66,40.64 v43.18,40.64
  Bottom 0.254: v43.18,40.64 43.18,59.69 45.72,62.23 50.8,62.23 53.34,64.77 U8.17
RED  (7 unrouted)
RED_1
  Bottom 0.406: U$10.Y1 33.02,139.7 A1.1
RED_2
  Bottom 0.406: U$10.Y2 43.18,137.16 A2.1
RED_3
  Bottom 0.406: U$10.Y3 53.34,134.62 A3.1
RED_4
  Bottom 0.406: U$10.Y4 63.5,132.08 A4.1
RED_5
  Bottom 0.406: U$10.Y5 73.66,129.54 A5.1
RED_6
  Bottom 0.406: U$10.Y6 83.82,127 A6.1
RED_7
  Bottom 0.406: U$10.Y7 93.98,124.46 A7.1
RED_8
  Bottom 0.406: U$10.Y8 104.14,121.92 A8.1
SCLK  (1 unrouted)
  Bottom 0.254: U2.25 73.66,85.09 72.39,83.82 72.39,68.58 | 72.39,48.26 72.39,68.58 | 72.39,48.26 72.39,27.94 73.66,26.67 U1.25 | U7.25 73.66,46.99 72.39,48.26 | U8.25 73.66,67.31 72.39,68.58 | U4.25 30.48,85.09 29.21,83.82 29.21,68.58 | 29.21,48.26 29.21,68.58 | 29.21,48.26 29.21,27.94 30.48,26.67 U3.25 | U5.25 30.48,46.99 29.21,48.26 | U6.25 30.48,67.31 29.21,68.58
VPRG  (1 unrouted)
  Bottom 0.254: U2.27 78.74,85.09 77.47,83.82 77.47,68.58 | 77.47,48.26 77.47,68.58 | 77.47,48.26 77.47,27.94 78.74,26.67 U1.27 | U7.27 78.74,46.99 77.47,48.26 | U8.27 78.74,67.31 77.47,68.58 | U4.27 35.56,85.09 34.29,83.82 34.29,68.58 | 34.29,48.26 34.29,68.58 | 34.29,48.26 34.29,27.94 35.56,26.67 U3.27 | U5.27 35.56,46.99 34.29,48.26 | U6.27 35.56,67.31 34.29,68.58
XLAT  (1 unrouted)
  Bottom 0.254: U2.24 71.12,85.09 69.85,83.82 69.85,68.58 | 69.85,48.26 69.85,68.58 | 69.85,48.26 69.85,27.94 71.12,26.67 U1.24 | U7.24 71.12,46.99 69.85,48.26 | U8.24 71.12,67.31 69.85,68.58 | U4.24 27.94,85.09 26.67,83.82 26.67,68.58 | 26.67,48.26 26.67,68.58 | 26.67,48.26 26.67,27.94 27.94,26.67 U3.24 | U5.24 27.94,46.99 26.67,48.26 | U6.24 27.94,67.31 26.67,68.58